# EAGLE design receiver (EAGLE 6.5.0)
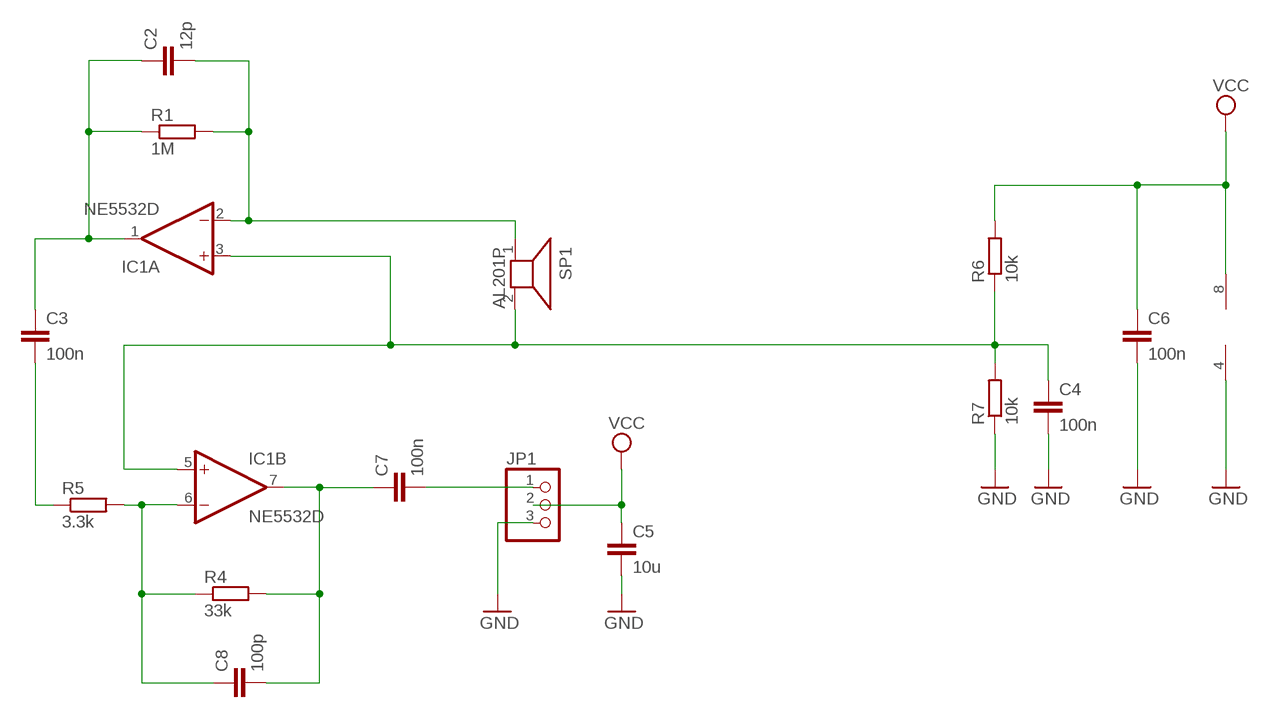
[diagram p0: schematic, sheet 1]

## Parts
C2  12p  C-EUC0805  [C0805]
C3  100n  C-EUC0805  [C0805]
C4  100n  C-EUC0805  [C0805]
C5  10u  C-EUC0805  [C0805]
C6  100n  C-EUC1206  [C1206]
C7  100n  C-EUC1206K  [C1206K]
C8  100p  C-EUC0805  [C0805]
IC1  NE5532D  [SO08]
JP1  PINHD-1X3  [1X03]
R1  1M  R-EU_R0805  [R0805]
R4  33k  R-EU_R0805  [R0805]
R5  3.3k  R-EU_R0805  [R0805]
R6  10k  R-EU_R0805  [R0805]
R7  10k  R-EU_R0805  [R0805]
SP1  AL201P  [AL201P]

## Nets
GND: C4.2 C5.2 C6.2 IC1.4(P:V-) JP1.3 R7.1
N$1: C7.2 JP1.1
N$3: C2.2 IC1.2(A:-IN) R1.2 SP1.1
N$4: C8.1 IC1.6(B:-IN) R4.1 R5.2
N$5: C7.1 C8.2 IC1.7(B:OUT) R4.2
N$6: C3.2 R5.1
N$8: C2.1 C3.1 IC1.1(A:OUT) R1.1
N$9: C4.1 IC1.3(A:+IN) IC1.5(B:+IN) R6.1 R7.2 SP1.2
VCC: C5.1 C6.1 IC1.8(P:V+) JP1.2 R6.2

## Library data of the parts
C2-C8 = resistor:C-EU: CAPACITOR, European symbol
IC1 = linear:NE5532: AUDIO AMPLIFIER
JP1 = pinhead:PINHD-1X3: PIN HEADER
R1 R4-R7 = resistor:R-EU_: RESISTOR, European symbol
SP1 = buzzer:AL201P: SPEAKER Source: Buerklin; OC_FARNELL: unknown; OC_NEWARK: unknown

## Board
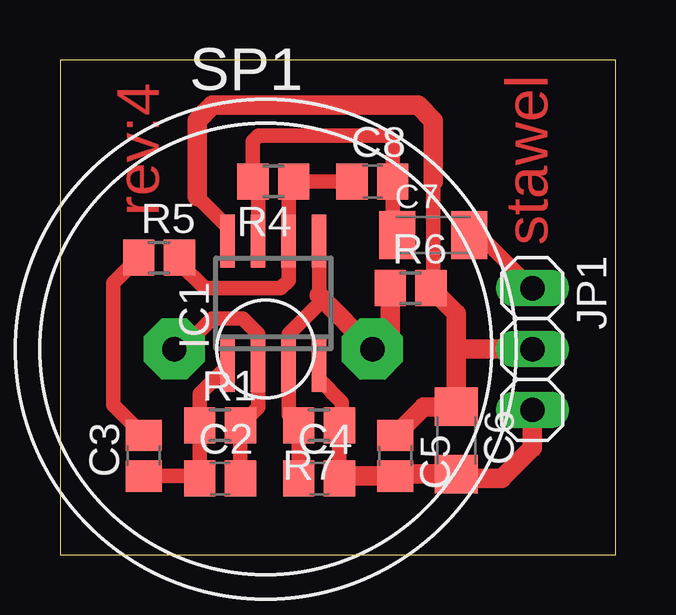
[diagram p1: board, top side]

Size 23.16 x 20.63 mm. Coordinates in mm from the lower left corner, seen from the top.
Outline: 0,0 23.16,0 23.16,20.63 0,20.63 0,0
Copper layers (1*16): Top 0.035mm / dielectric 1.5mm / Bottom 0.035mm
Design rules "default": minimum track width 10mil, minimum drill 24mil, track to track 8mil, track to pad 8mil, pad to pad 8mil, via to via 8mil, smd to smd 8mil, copper to edge 40mil, drill to drill 8mil, minimum pad ring 10mil, minimum via ring 8mil, stop-mask expansion 4mil, vias tented up to drill 0mil, thermal gap 10mil

### Footprints (pad centres in the part's own frame; a part is rotated, then mirrored left to right if it is on the bottom)
C0805 = smd 1.3 x 1.5: 1 -0.85,0; 2 0.85,0
C1206 = smd 1.6 x 1.8: 1 -1.4,0; 2 1.4,0
C1206K = smd 1.5 x 2: 1 -1.5,0; 2 1.5,0
SO08 = smd 0.6 x 2.2: 1 -1.905,-2.6; 2 -0.635,-2.6; 3 0.635,-2.6; 4 1.905,-2.6; 5 1.905,2.6; 6 0.635,2.6; 7 -0.635,2.6; 8 -1.905,2.6
1X03 = drill 1.016 long: 1 -2.54,0; 2 0,0; 3 2.54,0
R0805 = smd 1.3 x 1.5: 1 -0.85,0; 2 0.85,0
AL201P = drill 1.016 pad 2.54 octagon: 1 -3.81,0; 2 4.445,0

### Placement (x,y rotation side)
C2  6.67,3.17 0 top
C3  3.49,4.13 90 top
C4  10.8,3.17 0 top
C5  13.97,4.13 270 top
C6  16.51,4.76 270 top
C7  15.56,13.34 0 top
C8  13.02,15.56 0 top
IC1  8.89,10.48 0 top
JP1  19.69,8.57 270 top
R1  6.67,5.4 0 top
R4  8.89,15.56 180 top
R5  4.13,12.38 0 top
R6  14.61,11.11 0 top
R7  10.8,5.4 180 top
SP1  8.57,8.57 0 top

### Tracks (layer width: path | path; a pad name or v marks a point on that pad's centre or on a via)
GND
  Top 0.61: C4.2 R7.1 11.75,5.4 11.75,6.35 10.8,7.3 IC1.4
  Top 0.813: JP1.3 19.69,4.44 18.41,3.17 16.7,3.17 C6.2 14.05,3.36 C5.2 11.75,3.28 C4.2
N$1
  Top 0.61: C7.2 17.46,13.34 JP1.1
N$3
  Top 0.61: C2.2 R1.2 8.26,6.13 IC1.2 8.26,9.21 7.62,9.84 6.35,9.84 5.08,8.57 SP1.1
N$4
  Top 0.61: R5.2 4.98,12.17 6.03,11.11 9.21,11.11 9.52,11.43 IC1.6 9.52,15.34 R4.1 C8.1
N$5
  Top 0.61: IC1.7 8.26,15.34 R4.2 8.04,17.25 8.26,17.46 13.65,17.46 13.87,17.25 C8.2 13.87,13.46 C7.1
N$6
  Top 0.61: C3.2 2.22,6.25 2.22,11.33 R5.1
N$8
  Top 0.61: IC1.1 5.82,6.71 R1.1 C2.1 5.71,3.17 5.61,3.28 C3.1
N$9
  Top 0.61: C4.1 R7.2 9.52,5.82 IC1.3 9.52,9.21 10.8,10.48 10.8,10.79 IC1.5
  Top 0.813: R6.1 13.76,9.31 SP1.2 10.8,10.79
VCC
  Top 0.61: IC1.8 6.98,13.65 5.71,14.92 | 15.56,15.56 15.56,11.22 R6.2
  Top 0.813: 15.56,11.01 R6.2 16.51,10.06 16.51,8.57 | 16.51,8.57 C6.1 15.16,6.16 C5.1 | 16.51,8.57 JP1.2 | 5.71,14.92 5.71,18.1 6.35,18.73 14.92,18.73 15.56,18.1 15.56,15.56

### Text on the board
Top: stawel | rev:4